# EAGLE design toilet_auto-OSH (EAGLE 7.6.0)
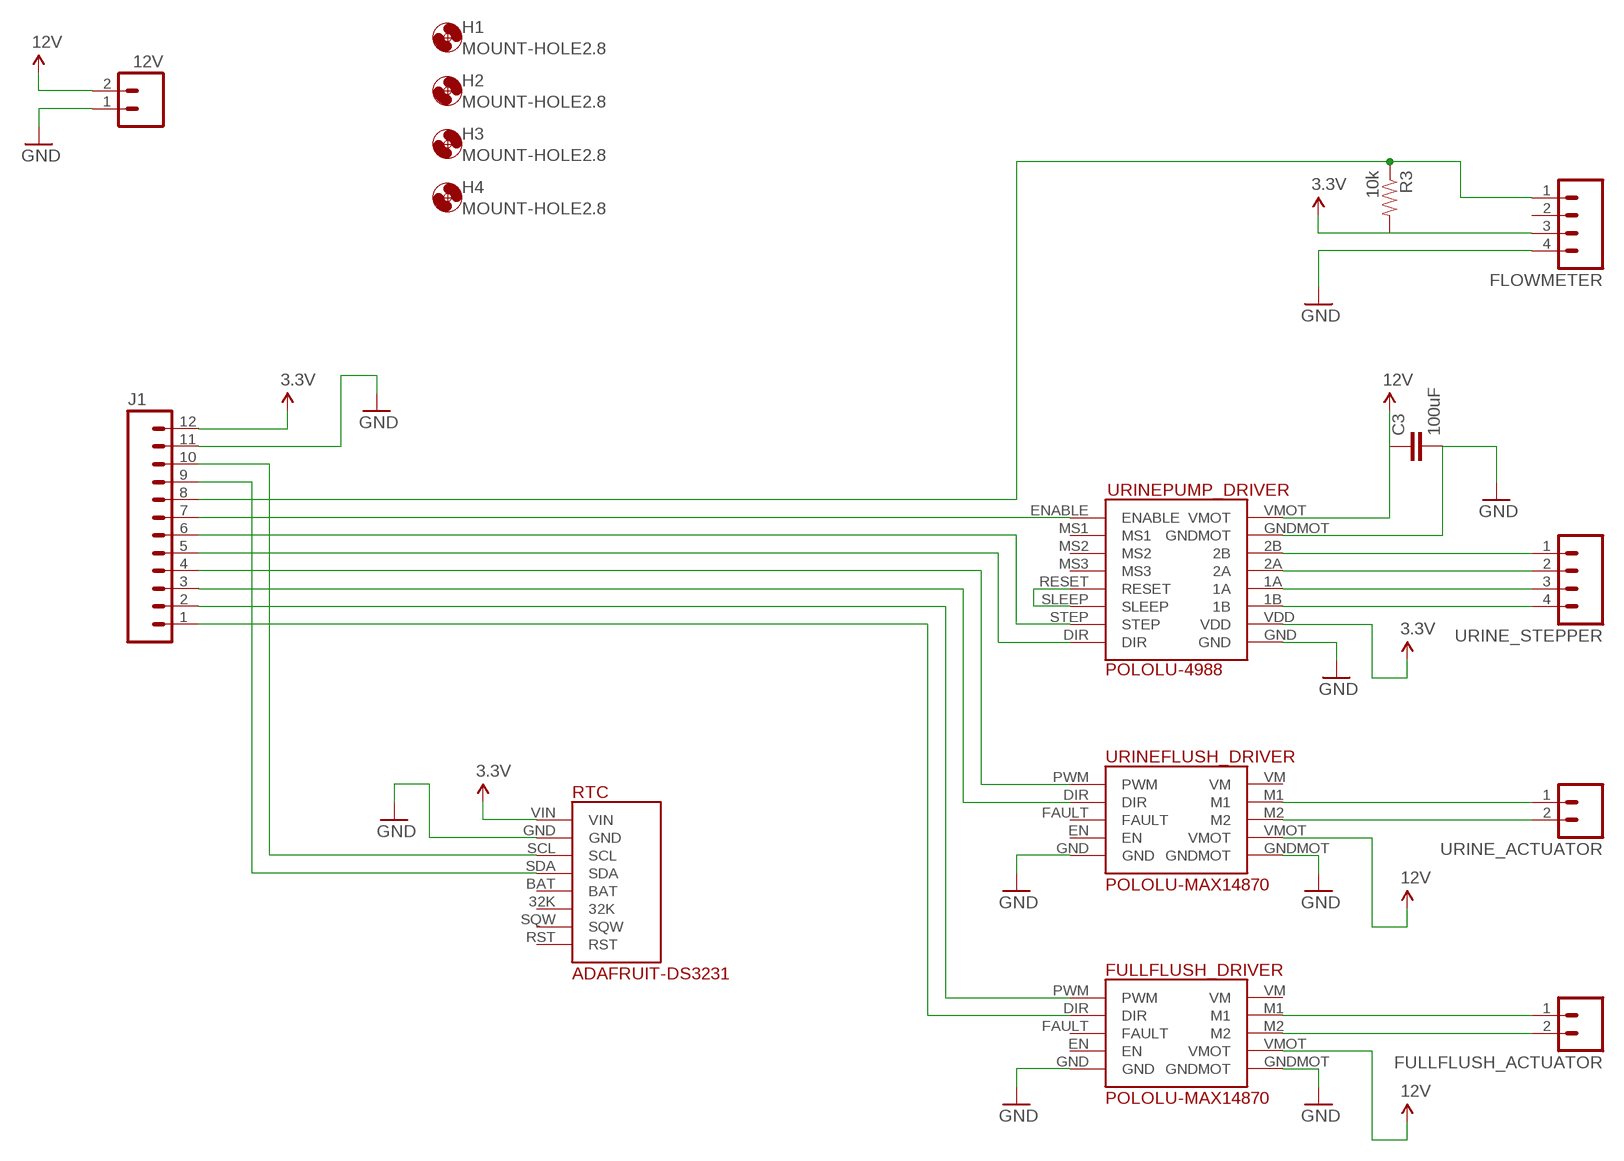
[diagram p0: schematic, sheet 1]

## Parts
12V  M02LOCK_LONGPADS  [1X02_LOCK_LONGPADS]
C3  100uF  0.1UF-50V-20%(PTH)KIT-EZ  [CAP-PTH-SMALL-KIT]
FLOWMETER  M04LOCK_LONGPADS  [1X04_LOCK_LONGPADS]
FULLFLUSH_ACTUATOR  M02LOCK_LONGPADS  [1X02_LOCK_LONGPADS]
FULLFLUSH_DRIVER  POLOLU-MAX14870  [POLOLU-MAX14870]
H1  MOUNT-HOLE2.8  [2,8]
H2  MOUNT-HOLE2.8  [2,8]
H3  MOUNT-HOLE2.8  [2,8]
H4  MOUNT-HOLE2.8  [2,8]
J1  M12LOCK_LONGPADS  [1X12_LOCK_LONGPADS]
R3  10k  RESISTOREZ  [AXIAL-0.3EZ]
RTC  ADAFRUIT-DS3231  [ADAFRUIT-DS3231]
URINE_ACTUATOR  M02LOCK_LONGPADS  [1X02_LOCK_LONGPADS]
URINE_STEPPER  M04LOCK_LONGPADS  [1X04_LOCK_LONGPADS]
URINEFLUSH_DRIVER  POLOLU-MAX14870  [POLOLU-MAX14870]
URINEPUMP_DRIVER  POLOLU-4988  [POLOLU-4988]

## Nets
3.3V: FLOWMETER.3 J1.12 R3.P$2 RTC.VIN URINEPUMP_DRIVER.VDD
12V: 12V.2 C3.1 FULLFLUSH_DRIVER.VMOT URINEFLUSH_DRIVER.VMOT URINEPUMP_DRIVER.VMOT
FLOW_PULSE: FLOWMETER.1 J1.8 R3.P$1
GND: 12V.1 C3.2 FLOWMETER.4 FULLFLUSH_DRIVER.GND FULLFLUSH_DRIVER.GNDMOT J1.11 RTC.GND URINEFLUSH_DRIVER.GND URINEFLUSH_DRIVER.GNDMOT URINEPUMP_DRIVER.GND URINEPUMP_DRIVER.GNDMOT
N$1: FULLFLUSH_DRIVER.PWM J1.2
N$2: URINE_ACTUATOR.1 URINEFLUSH_DRIVER.M1
N$3: URINE_STEPPER.1 URINEPUMP_DRIVER.2B
N$4: URINE_ACTUATOR.2 URINEFLUSH_DRIVER.M2
N$5: FULLFLUSH_ACTUATOR.1 FULLFLUSH_DRIVER.M1
N$6: FULLFLUSH_ACTUATOR.2 FULLFLUSH_DRIVER.M2
N$7: URINE_STEPPER.2 URINEPUMP_DRIVER.2A
N$8: URINE_STEPPER.3 URINEPUMP_DRIVER.1A
N$9: URINE_STEPPER.4 URINEPUMP_DRIVER.1B
N$10: URINEPUMP_DRIVER.RESET URINEPUMP_DRIVER.SLEEP
N$11: J1.5 URINEPUMP_DRIVER.DIR
N$12: J1.6 URINEPUMP_DRIVER.STEP
N$13: J1.4 URINEFLUSH_DRIVER.PWM
N$14: J1.3 URINEFLUSH_DRIVER.DIR
N$15: J1.7 URINEPUMP_DRIVER.ENABLE
N$16: FULLFLUSH_DRIVER.DIR J1.1
N$23: J1.10 RTC.SCL
N$24: J1.9 RTC.SDA
Unconnected: FLOWMETER.2 FULLFLUSH_DRIVER.EN FULLFLUSH_DRIVER.FAULT FULLFLUSH_DRIVER.VM RTC.32K RTC.BAT RTC.RST RTC.SQW URINEFLUSH_DRIVER.EN URINEFLUSH_DRIVER.FAULT URINEFLUSH_DRIVER.VM URINEPUMP_DRIVER.MS1 URINEPUMP_DRIVER.MS2 URINEPUMP_DRIVER.MS3

## Library data of the parts
12V FULLFLUSH_ACTUATOR URINE_ACTUATOR = SparkFun-Connectors:M02: Standard 2-pin 0.1" header. Use with - straight break away headers ( PRT-00116) - right angle break away headers (PRT-00553) - swiss pins (PRT-00743) - machine pins (PRT-00117) - female headers (PRT-00115) Molex polarized connector foot print use with: PRT-08233 with associated crimp pins and housings. 2.54_SCREWTERM for use with PRT-10571. 3.5mm Screw Terminal footprints for PRT-08084 5mm Screw Terminal footprints for use with PRT-08432
C3 = SparkFun-Capacitors:0.1UF-50V-20%(PTH): CAP-08370; PROD_ID: CAP-08370
FLOWMETER URINE_STEPPER = SparkFun-Connectors:M04: Header 4 Standard 4-pin 0.1" header. Use with straight break away headers (SKU : PRT-00116), right angle break away headers (PRT-00553), swiss pins (PRT-00743), machine pins (PRT-00117), and female headers (PRT-00115). Molex polarized connector foot print use with SKU : PRT-08231 with associated crimp pins and housings. 1MM SMD Version SKU: PRT-10208; PROD_ID: CONN-09696
FULLFLUSH_DRIVER URINEFLUSH_DRIVER = dotson:POLOLU-MAX14870
H1-H4 = holes:MOUNT-HOLE: MOUNTING HOLE with drill center marker
J1 = SparkFun-Connectors:M12: Header 12 Standard 12-pin 0.1" header. Use with straight break away headers (SKU : PRT-00116), right angle break away headers (PRT-00553), swiss pins (PRT-00743), machine pins (PRT-00117), and female headers (PRT-00115).
R3 = SparkFun-Passives:RESISTOR: Resistor Basic schematic elements and footprints for 0603, 1206, and PTH resistors.
RTC = dotson:ADAFRUIT-DS3231
URINEPUMP_DRIVER = dotson:POLOLU-4988: Pololu 4988 stepper motor driver footprint

## Board
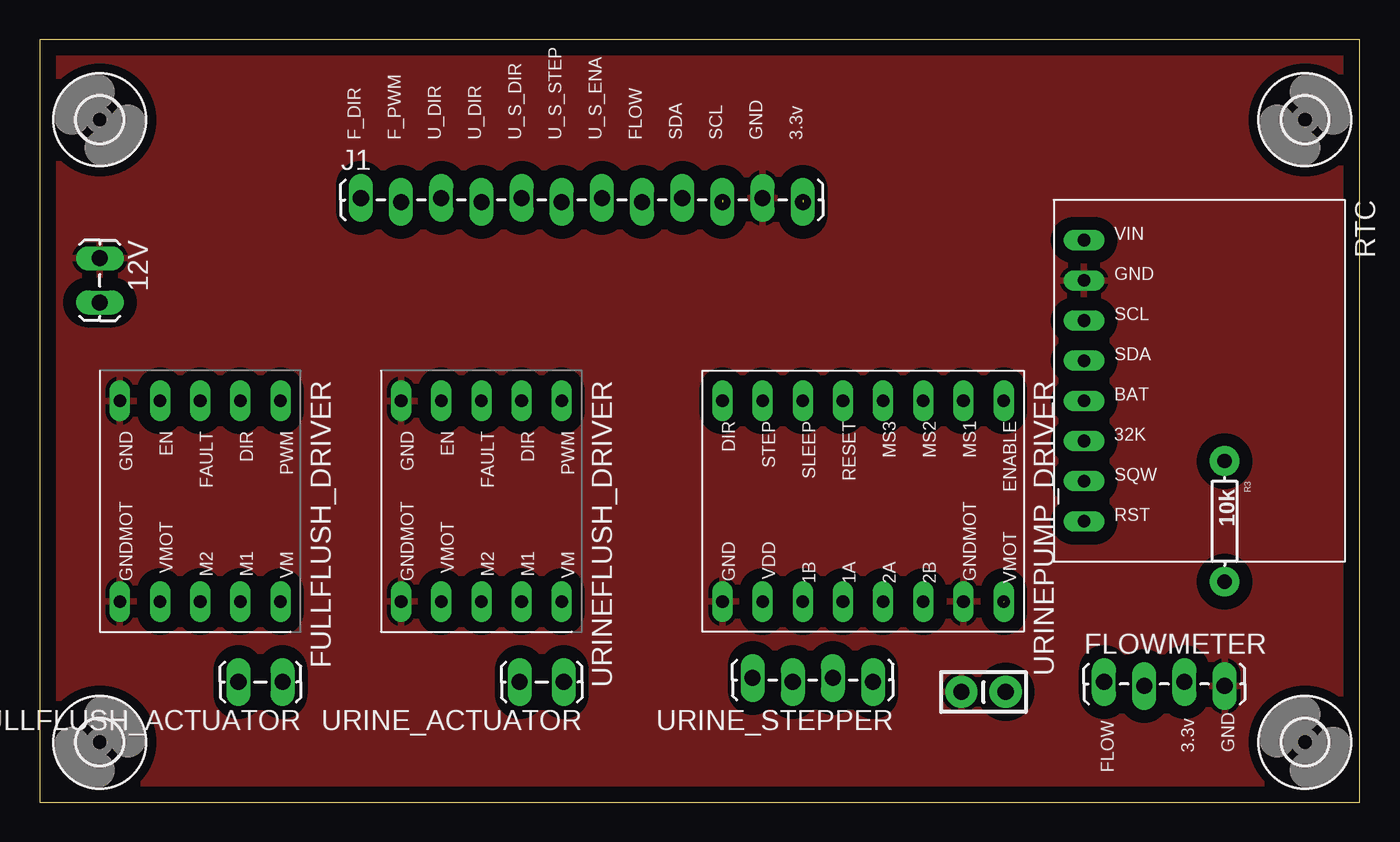
[diagram p1: board, top side]
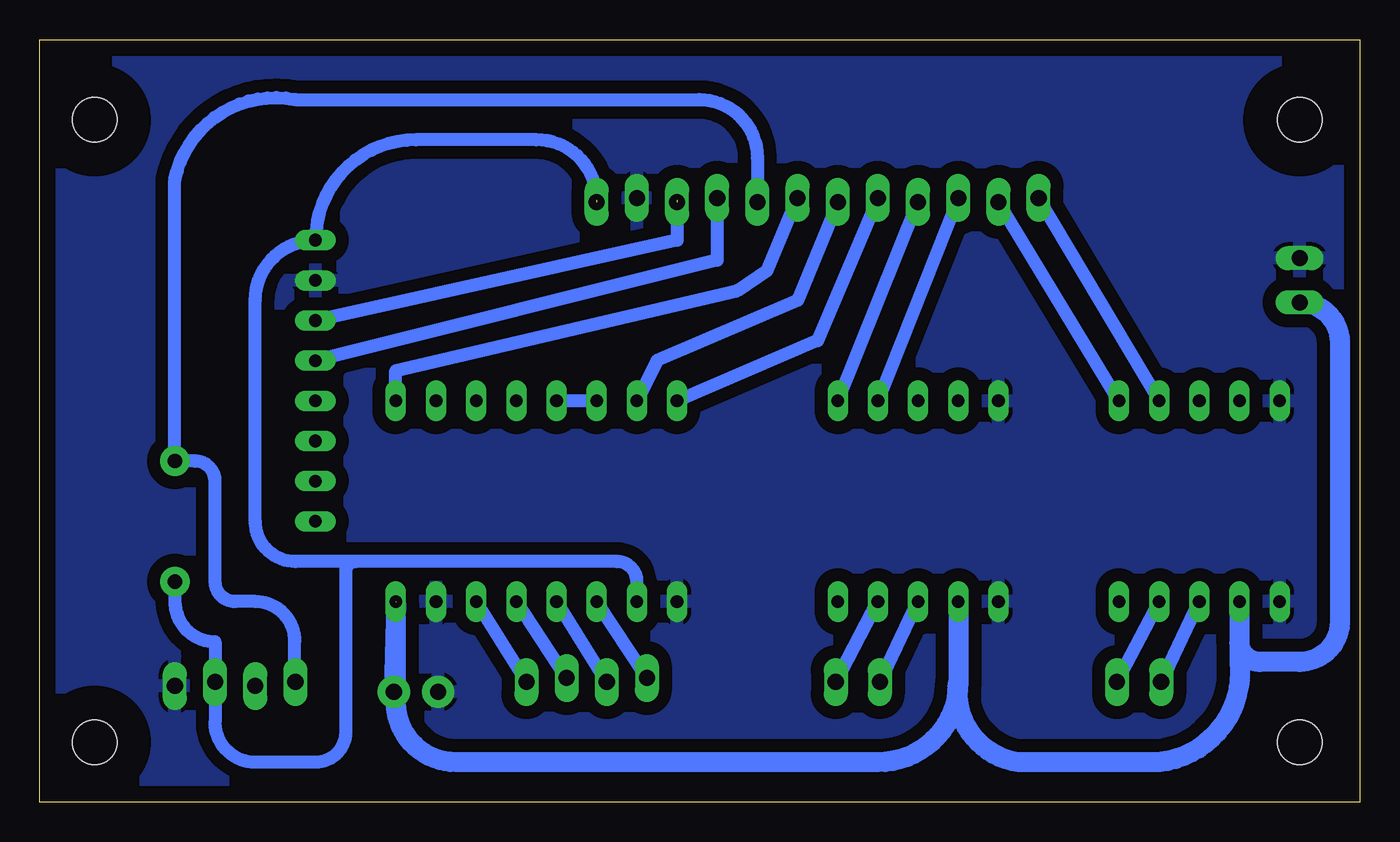
[diagram p2: board, bottom side, seen from below]

Size 83.49 x 48.25 mm. Coordinates in mm from the lower left corner, seen from the top.
Outline: 0,0 83.49,0 83.49,48.25 0,48.25 0,0
Copper layers (1*16): Top 0.035mm / dielectric 1.5mm / Bottom 0.035mm
Design rules "default *": minimum track width 31mil, minimum drill 24mil, track to track 32mil, track to pad 32mil, pad to pad 32mil, via to via 32mil, smd to smd 8mil, copper to edge 40mil, drill to drill 31mil, minimum pad ring 10mil, minimum via ring 8mil, stop-mask expansion 4mil, vias tented up to drill 0mil, thermal gap 10mil

### Footprints (pad centres in the part's own frame; a part is rotated, then mirrored left to right if it is on the bottom)
1X02_LOCK_LONGPADS = drill 1.016 long: 1 -0.127,0; 2 2.667,0
CAP-PTH-SMALL-KIT = drill 1.016 pad 2.032: 1 -1.397,0; 2 1.397,0
1X04_LOCK_LONGPADS = drill 1.016 long: 1 0,0; 2 2.54,-0.254; 3 5.08,0; 4 7.62,-0.254
POLOLU-MAX14870 = drill 0.8 long: DIR 1.27,8.89; EN 1.27,3.81; FAULT 1.27,6.35; GND 1.27,1.27; GNDMOT 13.97,1.27; M1 13.97,8.89; M2 13.97,6.35; PWM 1.27,11.43; VM 13.97,11.43; VMOT 13.97,3.81
2,8 = hole 2.8: 0,0
1X12_LOCK_LONGPADS = drill 1.016 long: 1 0,0.127; 2 2.54,-0.127; 3 5.08,0.127; 4 7.62,-0.127; 5 10.16,0.127; 6 12.7,-0.127; 7 15.24,0.127; 8 17.78,-0.127; 9 20.32,0.127; 10 22.86,-0.127; 11 25.4,0.127; 12 27.94,-0.127
AXIAL-0.3EZ = drill 0.9 pad 1.88: P$1 -3.81,0; P$2 3.81,0
ADAFRUIT-DS3231 = drill 0.8 long: 32K 15.24,1.27; BAT 12.7,1.27; GND 5.08,1.27; RST 20.32,1.27; SCL 7.62,1.27; SDA 10.16,1.27; SQW 17.78,1.27; VIN 2.54,1.27
POLOLU-4988 = drill 0.8 long: 1A 13.97,8.89; 1B 13.97,6.35; 2A 13.97,11.43; 2B 13.97,13.97; DIR 1.27,1.27; ENABLE 1.27,19.05; GND 13.97,1.27; GNDMOT 13.97,16.51; MS1 1.27,16.51; MS2 1.27,13.97; MS3 1.27,11.43; RESET 1.27,8.89; SLEEP 1.27,6.35; STEP 1.27,3.81; VDD 13.97,3.81; VMOT 13.97,19.05

### Placement (x,y rotation side)
12V  3.81,34.29 270 top
C3  59.69,6.99 180 top
FLOWMETER  67.31,7.62 0 top
FULLFLUSH_ACTUATOR  15.24,7.62 180 top
FULLFLUSH_DRIVER  3.81,26.67 270 top
H1  80.01,43.18 0 top
H2  3.81,3.81 0 top
H3  80.01,3.81 90 top
H4  3.81,43.18 90 top
J1  20.32,38.1 0 top
R3  74.93,17.78 270 top
RTC  64.77,38.1 270 top
URINE_ACTUATOR  33.02,7.62 180 top
URINE_STEPPER  52.7,7.62 180 top
URINEFLUSH_DRIVER  21.59,26.67 270 top
URINEPUMP_DRIVER  41.91,26.67 270 top

### Tracks (layer width: path | path; a pad name or v marks a point on that pad's centre or on a via)
3.3V  (1 unrouted)
  Bottom 0.813: URINEPUMP_DRIVER.VDD 45.72,13.97 arc-90 46.99,15.24 63.5,15.24 | 63.5,15.24 arc-90 64.14,14.61 64.14,4.44 arc90 66.04,2.54 69.85,2.54 arc90 72.39,5.08 FLOWMETER.3 72.39,10.16 arc90 74.93,12.7 R3.P$2 | 48.26,38.1 arc-90 52.07,41.91 59.69,41.91 arc-90 RTC.VIN arc-90 69.85,31.75 69.85,17.78 arc-90 67.31,15.24 63.5,15.24
12V  (1 unrouted)
  Bottom 0.813: 7.62,10.16 FULLFLUSH_DRIVER.VMOT
  Bottom 1.27: 60.95,12.66 C3.1 | 7.62,10.16 arc-90 6.35,8.89 3.81,8.89 arc-90 1.27,11.43 1.27,29.08 arc-90 12V.2 | FULLFLUSH_DRIVER.VMOT 7.62,8.89 arc90 12.7,2.54 21.59,2.54 arc90 25.4,7.62 | URINEFLUSH_DRIVER.VMOT 25.4,7.62 | 25.4,7.62 arc90 30.48,2.54 57.15,2.54 arc90 60.96,6.35 URINEPUMP_DRIVER.VMOT
FLOW_PULSE
  Bottom 0.787: 67.35,8.38 FLOWMETER.1
  Bottom 0.813: 67.35,8.38 67.35,10.2 arc-90 69.85,12.7 71.12,12.7 arc90 72.39,13.97 72.39,20.32 arc-90 73.66,21.59 R3.P$1 74.93,39.37 arc90 67.31,44.45 41.78,44.45 arc90 38.1,40.77 J1.8
GND
  pour Bottom: 0,48.26 83.82,48.26 83.82,0 0,0
  pour Top: 0,48.26 83.82,48.26 83.82,0 0,0
N$1
  Bottom 0.813: FULLFLUSH_DRIVER.PWM J1.2
N$2
  Bottom 0.813: URINE_ACTUATOR.1 URINEFLUSH_DRIVER.M1
N$3
  Bottom 0.813: URINE_STEPPER.1 URINEPUMP_DRIVER.2B
N$4
  Bottom 0.813: URINE_ACTUATOR.2 URINEFLUSH_DRIVER.M2
N$5
  Bottom 0.813: FULLFLUSH_ACTUATOR.1 FULLFLUSH_DRIVER.M1
N$6
  Bottom 0.813: FULLFLUSH_ACTUATOR.2 FULLFLUSH_DRIVER.M2
N$7
  Bottom 0.813: URINE_STEPPER.2 URINEPUMP_DRIVER.2A
N$8
  Bottom 0.813: URINE_STEPPER.3 URINEPUMP_DRIVER.1A
N$9
  Bottom 0.813: URINE_STEPPER.4 URINEPUMP_DRIVER.1B
N$10
  Bottom 0.813: URINEPUMP_DRIVER.SLEEP URINEPUMP_DRIVER.RESET
N$11
  Bottom 0.813: J1.5 34.29,29.21 URINEPUMP_DRIVER.DIR
N$12
  Bottom 0.813: J1.6 35.56,31.75 44.45,27.94 URINEPUMP_DRIVER.STEP
N$13
  Bottom 0.813: URINEFLUSH_DRIVER.PWM J1.4
N$14
  Bottom 0.813: J1.3 URINEFLUSH_DRIVER.DIR
N$15
  Bottom 0.813: URINEPUMP_DRIVER.ENABLE 60.96,27.3 39.37,32.39 37.46,33.66 J1.7
N$16
  Bottom 0.813: J1.1 FULLFLUSH_DRIVER.DIR
N$23  (1 unrouted)
  Bottom 0.813: 43.18,38.1 43.18,35.56 RTC.SCL
N$24
  Bottom 0.813: J1.9 40.64,34.29 RTC.SDA

### Text on the board
tPlace: F_DIR | F_PWM | U_DIR | U_DIR | U_S_DIR | U_S_STEP | U_S_ENA | FLOW | SDA | SCL | GND | 3.3v | 3.3v | GND | FLOW